# Altium project DiPho_analog.PrjPcb
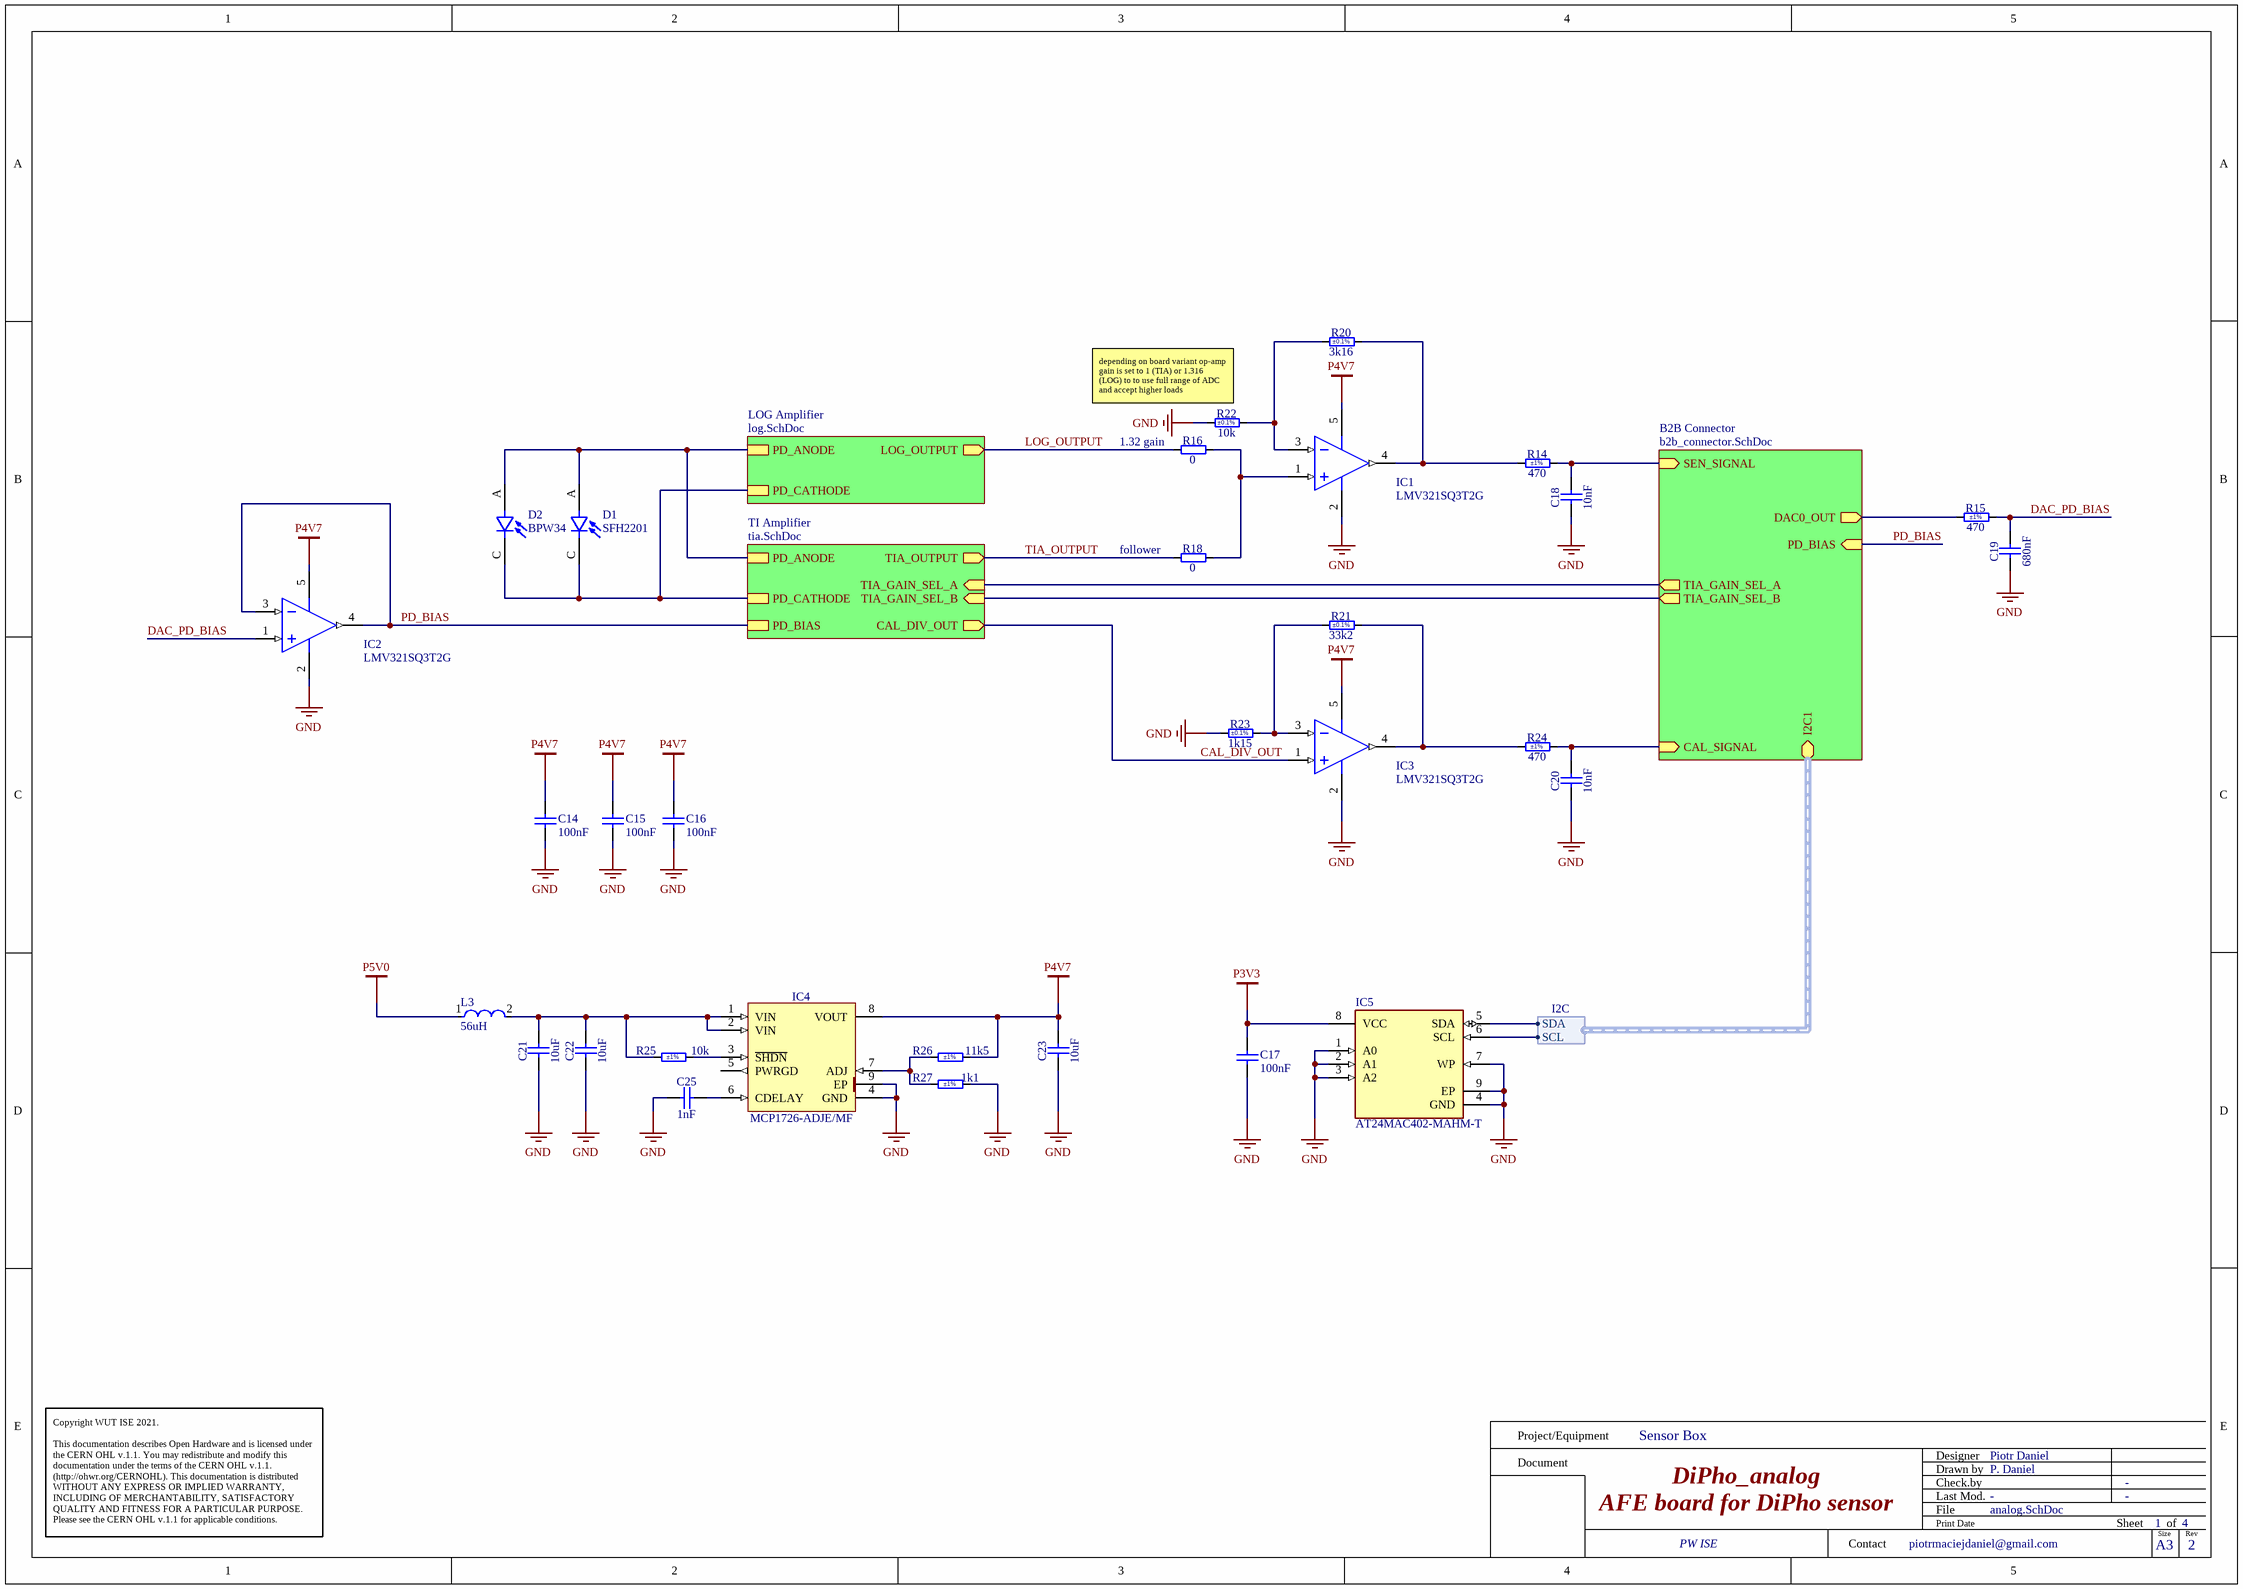
[diagram p0: analog.SchDoc]
4 sheets, 66 parts. Net scope: hierarchical (ports join the sheet entries above them; power ports are global).
Board file: DiPho_AFE.PcbDoc
Sheets:
  analog.SchDoc
    LOG Amplifier = log.SchDoc
    TI Amplifier = tia.SchDoc
    B2B Connector = b2b_connector.SchDoc

## Sheet analog.SchDoc: DiPho_analog
size 420 x 297 mm; Author: P. Daniel; CompanyName: WUT ISE; DrawnBy: P. Daniel; Organization: WUT ISE; Address1: PW ISE; Address2: Nowowiejska 15/19 00-665 Warsaw; Address3: piotrmaciejdaniel@gmail.com; Revision: 2; SheetNumber: 1; SheetTotal: 4; ModifiedBy: -; CheckedDate: -; Title2: AFE board for DiPho sensor; DivGrp: WUT ISE; Designer: Piotr Daniel; ModifiedDate: -; ProjectName: Sensor Box

### Parts
C14  100nF  [CAPC1005X55N]
C15  100nF  [CAPC1005X55N]
C16  100nF  [CAPC1005X55N]
C17  100nF  [CAPC1005X55N]
C18  10nF  [CAPC1005X55N]
C19  680nF  [CAPC1005X55N]
C20  10nF  [CAPC1005X55N]
C21  10uF  [CAPC2012X135N]
C22  10uF  [CAPC2012X135N]
C23  10uF  [CAPC2012X135N]
C25  1nF  [CAPC1005X55N]
D1  SFH2201  [SFH_2201]
D2  BPW34  [BPW34]
IC1  LMV321SQ3T2G  [ONSC-SC70-5-419A-02_K_N]
IC2  LMV321SQ3T2G  [ONSC-SC70-5-419A-02_K_N]
IC3  LMV321SQ3T2G  [ONSC-SC70-5-419A-02_K_N]
IC4  MCP1726-ADJE/MF  [SON65P300X300X100-9N-R160X240]
IC5  AT24MAC402-MAHM-T  [FP-C04-21355-Q4B-MFG]
L3  56uH  [FP-LQH3NPH_ME-MFG]
R14  470  Tolerance: ±1%  [RESC1005X40N]
R15  470  Tolerance: ±1%  [RESC1005X40N]
R16  0  [RESC1005X40N]
R18  0  [RESC1005X40N]
R20  3k16  Tolerance: ±0.1%  [RESC1005X35N]
R21  33k2  Tolerance: ±0.1%  [RESC1005X40N]
R22  10k  Tolerance: ±0.1%  [RESC1005X35N]
R23  1k15  Tolerance: ±0.1%  [RESC1005X35N]
R24  470  Tolerance: ±1%  [RESC1005X40N]
R25  10k  Tolerance: ±1%  [RESC1005X40N]
R26  11k5  Tolerance: ±1%  [RESC1005X40N]
R27  1k1  Tolerance: ±1%  [RESC1005X40N]

### Sub-sheets
B2B Connector = b2b_connector.SchDoc: TIA_GAIN_SEL_A (out), TIA_GAIN_SEL_B (out), I2C1 (bidir, harness I2C), CAL_SIGNAL (in), SEN_SIGNAL (in), DAC0_OUT (out), PD_BIAS (in)
LOG Amplifier = log.SchDoc: LOG_OUTPUT (out), PD_ANODE, PD_CATHODE
TI Amplifier = tia.SchDoc: PD_ANODE, PD_CATHODE, TIA_OUTPUT (out), TIA_GAIN_SEL_A (in), TIA_GAIN_SEL_B (in), PD_BIAS, CAL_DIV_OUT (out)

### Harnesses
I2C: SCL, SDA

### Nets
GND: C14.1 C15.1 C16.1 C17.1 C18.1 C19.1 C20.1 C21.1 C22.1 C23.1 C25.1 IC1.2(V-) IC2.2(V-) IC3.2(V-) IC4.4(GND) IC4.9(EP) IC5.1(A0) IC5.2(A1) IC5.3(A2) IC5.4(GND) IC5.7(WP) IC5.9(EP) R22.1 R23.1 R27.2
P3V3: C17.2 IC5.8(VCC)
P4V7: C14.2 C15.2 C16.2 C23.2 IC1.5(V+) IC2.5(V+) IC3.5(V+) IC4.8(VOUT) R26.2
P5V0: L3.1
CAL_DIV_OUT: IC3.1(IN+) ; sheet TI Amplifier/CAL_DIV_OUT
DAC_PD_BIAS: C19.2 IC2.1(IN+) R15.2
LOG_OUTPUT: R16.1 ; sheet LOG Amplifier/LOG_OUTPUT
PD_BIAS: IC2.3(IN-) IC2.4(OUT) ; sheet TI Amplifier/PD_BIAS, sheet B2B Connector/PD_BIAS
TIA_OUTPUT: R18.1 ; sheet TI Amplifier/TIA_OUTPUT
NetC18_2: C18.2 R14.2 ; sheet B2B Connector/SEN_SIGNAL
NetC20_2: C20.2 R24.2 ; sheet B2B Connector/CAL_SIGNAL
NetC21_2: C21.2 C22.2 IC4.1(VIN) IC4.2(VIN) L3.2 R25.1
NetC25_2: C25.2 IC4.6(CDELAY)
NetD1_A: D1.A D2.A ; sheet LOG Amplifier/PD_ANODE, sheet TI Amplifier/PD_ANODE
NetD1_C: D1.C D2.C ; sheet LOG Amplifier/PD_CATHODE, sheet TI Amplifier/PD_CATHODE
NetIC1_1: IC1.1(IN+) R16.2 R18.2
NetIC1_3: IC1.3(IN-) R20.1 R22.2
NetIC1_4: IC1.4(OUT) R14.1 R20.2
NetIC3_3: IC3.3(IN-) R21.1 R23.2
NetIC3_4: IC3.4(OUT) R21.2 R24.1
NetIC4_3: IC4.3(~{SHDN}) R25.2
NetIC4_7: IC4.7(ADJ) R26.1 R27.1
NetIC5_5: IC5.5(SDA) ; sheet B2B Connector/I2C1.SDA
NetIC5_6: IC5.6(SCL) ; sheet B2B Connector/I2C1.SCL
NetJ1_2: sheet TI Amplifier/TIA_GAIN_SEL_A, sheet B2B Connector/TIA_GAIN_SEL_A
NetJ1_4: sheet TI Amplifier/TIA_GAIN_SEL_B, sheet B2B Connector/TIA_GAIN_SEL_B
NetJ1_8: R15.1 ; sheet B2B Connector/DAC0_OUT

Not connected (* = marked no-connect by the designer): IC4 5(PWRGD)

### Notes on the sheet
- (near R22) depending on board variant op-amp gain is set to 1 (TIA) or 1.316 (LOG) to to use full range of ADC and accept higher loads
- (near R16) 1.32 gain
- (near R18) follower
- Project/Equipment
- Document
- Designer
- Drawn by
- Check.by
- Copyright WUT ISE 2021.
  This documentation describes Open Hardware and is licensed under the CERN OHL v.1.1. You may redistribute and modify this documentation under the terms of the CERN OHL v.1.1. (http://ohwr.org/CERNOHL). This documentation is distributed WITHOUT ANY EXPRESS OR IMPLIED WARRANTY, INCLUDING OF MERCHANTABILITY, SATISFACTORY QUALITY AND FITNESS FOR A PARTICULAR PURPOSE. Please see the CERN OHL v.1.1 for applicable conditions.
- Contact
- File
- Last Mod.
- Print Date
- Sheet
- Size
- A3
- of
- Rev

### Library data of the parts
C14-C17 = CC0402_100NF_16V_10%_X7R: Non-polarised capacitor; Manufacturer: GENERIC; Part Description: SMD Multilayer Chip Ceramic Capacitor; Manufacturer1 Part Number: GRM155R71C104KA88D; Tolerance: ±10%; Voltage: 16V; TC: X7R; Part Number: CC0402_100NF_16V_10%_X7R; Component Kind: Standard; Component Type: Standard; Pin Count: 2; Value: 100nF; Status: Not Recommended; Manufacturer Part Number: CC0402_100NF_16V_10%_X7R; Case: 0402; Mounted: Yes; Socket: No; SMD: Yes; Sense: No; Manufacturer1 Example: MURATA; Manufacturer1 ComponentHeight: 0.55mm; HelpURL: \\cern.ch\dfs\Applications\Altium\Datasheets\CC0402_X7R_MURATA_GRM.pdf; Author: CERN DEM JLC; CreateDate: 05.12.2013; LatestRevisionDate: 03.12.2007
C18 C20 = CC0402_10NF_16V_10%_X7R: Non-polarised capacitor; Part Description: SMD Multilayer Chip Ceramic Capacitor; Manufacturer: GENERIC; Manufacturer1 Part Number: 223878715636; Voltage: 16V; TC: X7R; Tolerance: ±10%; Part Number: CC0402_10NF_16V_10%_X7R; Component Kind: Standard; Component Type: Standard; Pin Count: 2; Value: 10nF; Status: Not Recommended; Manufacturer Part Number: CC0402_10NF_16V_10%_X7R; Case: 0402; Mounted: Yes; Socket: No; SMD: Yes; Sense: No; Manufacturer1 Example: PHYCOMP; Manufacturer1 ComponentHeight: 0.55mm; HelpURL: \\cern.ch\dfs\Applications\Altium\Datasheets\CC0402_X7R_PHYCOMP.pdf; Author: CERN DEM JLC; CreateDate: 03.12.2007; LatestRevisionDate: 03.12.2007
C19 = CC0402_680NF_10V_10%_X5R: Non-polarised capacitor; Part Description: SMD Multilayer Chip Ceramic Capacitor; Manufacturer: GENERIC; Manufacturer1 Part Number: GRM155R61A684KE15; Voltage: 10V; TC: X5R; Tolerance: ±10%; Part Number: CC0402_680NF_10V_10%_X5R; Component Kind: Standard; Component Type: Standard; Pin Count: 2; Value: 680nF; Status: None; Manufacturer Part Number: CC0402_680NF_10V_10%_X5R; Case: 0402; Mounted: Yes; Socket: No; SMD: Yes; Sense: No; Manufacturer1 Example: MURATA; Manufacturer1 ComponentHeight: 0.55mm; HelpURL: \\cern.ch\dfs\Applications\Altium\Datasheets\CC0402_X5R_MURATA_GRM.pdf; Author: CERN DEM BC; CreateDate: 19.04.2021; LatestRevisionDate: 19.04.2021
C21-C23 = CC0805_10UF_10V_10%_X7R: Non-polarised capacitor; Part Description: SMD Multilayer Chip Ceramic Capacitor; Manufacturer: GENERIC; Manufacturer1 Part Number: GRM21BR71A106KE51L; Voltage: 10V; TC: X7R; Tolerance: ±10%; Part Number: CC0805_10UF_10V_10%_X7R; Component Kind: Standard; Component Type: Standard; Pin Count: 2; Value: 10uF; Status: Preferred; Manufacturer Part Number: CC0805_10UF_10V_10%_X7R; Case: 0805; Mounted: Yes; Socket: No; SMD: Yes; Sense: No; Manufacturer1 Example: MURATA; Manufacturer1 ComponentHeight: 1.35mm; HelpURL: \\cern.ch\dfs\Applications\Altium\Datasheets\CC0805_X7R_MURATA.pdf; Author: CERN DEM JLC; CreateDate: 30.04.2012; LatestRevisionDate: 30.04.2012
C25 = CC0402_1NF_50V_10%_X7R: Non-polarised capacitor; Part Description: SMD Multilayer Chip Ceramic Capacitor; Manufacturer: GENERIC; Manufacturer1 Part Number: 223858715623; Voltage: 50V; TC: X7R; Tolerance: ±10%; Part Number: CC0402_1NF_50V_10%_X7R; Component Kind: Standard; Component Type: Standard; Pin Count: 2; Value: 1nF; Status: Not Recommended; Manufacturer Part Number: CC0402_1NF_50V_10%_X7R; Case: 0402; Mounted: Yes; Socket: No; SMD: Yes; Sense: No; Manufacturer1 Example: PHYCOMP; Manufacturer1 ComponentHeight: 0.55mm; HelpURL: \\cern.ch\dfs\Applications\Altium\Datasheets\CC0402_X7R_PHYCOMP.pdf; Author: CERN DEM JLC; CreateDate: 03.12.2007; LatestRevisionDate: 03.12.2007
D2 = BPW34: VISHAY - BPW34 - Photodiode, 65 °, 2 nA, 900 nm, DIP-2; Wavelength: 900nm; Rise Time: 100ns; Dark Current: 2nA; Power Dissipation: 215mW; Reverse Breakdown Voltage: 60V; Viewing Angle: 130°; Diode Type: PIN; Lens Style: Clear; Supplier 1: Digi-Key; Manufacturer: Vishay; Manufacturer Part Number: BPW34; RoHS: Yes; Category: Photodiodes; Stock 1: 56; Pricing 1: 1=1,06000, 10=0,94400, 100=0,73630, 500=0,60822, 1000=0,48018, 2000=0,45300 (USD); Mount: Through Hole,PCB; Case/Package: DIP; Number of Pins: 2; Contact Plating: Tin; Min Operating Temperature: -40°C; Max Operating Temperature: 100°C; Fall Time: 100ns; Packaging: Bulk; Max Reverse Voltage (DC): 60V; Package Quantity: 3000; Max Power Dissipation: 215mW; Reverse Voltage (DC): 60V; Breakdown Voltage: 60V; Length: 4.5mm; Width: 4.3mm; Height: 2mm; Radiation Hardening: No; REACH SVHC: Unknown; Lead Free: Lead Free; ComponentLink1URL: https://datasheet.ciiva.com/1248/33605-1248690.pdf?src-supplier=Element14; ComponentLink1Description: https://datasheet.ciiva.com/1248/33605-1248690.pdf?src-supplier=Element14; ComponentLink2URL: https://datasheet.ciiva.com/1249/bpw34-1249073.pdf?src-supplier=Element14; ComponentLink2Description: https://datasheet.ciiva.com/1249/bpw34-1249073.pdf?src-supplier=Element14; ComponentLink3URL: https://datasheet.ciiva.com/25620/0900766b80de9fc5-25620357.pdf?src-supplier=RSComponents; ComponentLink3Description: https://datasheet.ciiva.com/25620/0900766b80de9fc5-25620357.pdf?src-supplier=RSComponents; ComponentLink4URL: https://datasheet.ciiva.com/4697/bpw34-79369-4697616.pdf?src-supplier=Mouser; ComponentLink4Description: https://datasheet.ciiva.com/4697/bpw34-79369-4697616.pdf?src-supplier=Mouser; ComponentLink5URL: https://datasheet.ciiva.com/1336/6514-1336219.pdf?src-supplier=Newark; ComponentLink5Description: https://datasheet.ciiva.com/1336/6514-1336219.pdf?src-supplier=Newark; ComponentLink6URL: https://datasheet.ciiva.com/4269/2bpw34-4269812.pdf?src-supplier=Arrow+Electronics; ComponentLink6Description: https://datasheet.ciiva.com/4269/2bpw34-4269812.pdf?src-supplier=Arrow+Electronics; ComponentLink7URL: https://datasheet.ciiva.com/15117/getdatasheetpartid-112064-15117125.pdf?src-supplier=Verical; ComponentLink7Description: https://datasheet.ciiva.com/15117/getdatasheetpartid-112064-15117125.pdf?src-supplier=Verical; ComponentLink8URL: https://datasheet.ciiva.com/1248/bpw34-1248686.pdf?src-supplier=Element14; ComponentLink8Description: https://datasheet.ciiva.com/1248/bpw34-1248686.pdf?src-supplier=Element14; ComponentLink9URL: https://datasheet.ciiva.com/1335/1809684-1335889.pdf?src-supplier=Newark; ComponentLink9Description: https://datasheet.ciiva.com/1335/1809684-1335889.pdf?src-supplier=Newark; ComponentLink10URL: https://datasheet.ciiva.com/2819/bpw34-2819744.pdf?src-supplier=Digi-Key; ComponentLink10Description: https://datasheet.ciiva.com/2819/bpw34-2819744.pdf?src-supplier=Digi-Key; ComponentLink11URL: https://datasheet.ciiva.com/8084/bpw34-8084840.pdf?src-supplier=Avnet; ComponentLink11Description: https://datasheet.ciiva.com/8084/bpw34-8084840.pdf?src-supplier=Avnet; Supplier Part Number 1: 751-1015-ND
IC1-IC3 = CMP-1310-00136-1: Single Low-Voltage, Rail-to-Rail Operational Amplifier, 2.7 to 5.5 V, -40 to 85 degC, 5-Pin SC70, Pb-Free, Tape and Reel; Manufacturer: On Semiconductor; VCC Max (V): 5.5; VCC Min (V): 2.7; SR Typ (V/uS): 1; ComponentLink2Description: Datasheet; ComponentLink1URL: http://www.onsemi.com/; DatasheetVersion: Rev. 10; PackageDescription: 5-Pin Small Outline Transistor, Body 2 x 1.25 mm, Pitch 0.65 mm; PartNumber: LMV321SQ3T2G; Packing: Tape and Reel; PackageVersion: Rev. K, 07/2010; ComponentLink1Description: Manufacturer URL; PackageReference: SC70-5-419A-02_K; ComponentLink3Description: Package Specification; GBW Typ (MHz): 1; ComponentLink3URL: http://www.onsemi.cn/pub_link/Collateral/LMV821-D.PDF; ComponentLink2URL: http://www.onsemi.cn/pub_link/Collateral/LMV321-LMV358-LMV324-D.PDF; Mounting Technology: Surface Mount; RoHS: TRUE
IC4 = MCP1726-ADJE/MF: 1A, 0.8V to 5.0V Adjustable , Low Quiescent Current LDO Regulator; Manufacturer: MICROCHIP TECHNOLOGY; PressFit: No; Bonding: No; Part Number: MCP1726-ADJE/MF; Component Kind: Standard; Component Type: Standard; Device: MCP1726-ADJE/MF; PackageDescription: SON, 0.65mm pitch, 8 pin, 3mm X 3mm X 1.00mm H body (w/thermal tab 1.60 X 2.4mm),  IPC Medium Density; Part Description: 1A, 0.8V to 5.0V Adjustable, Low Quiescent Current LDO Regulator; Manufacturer Part Number: MCP1726-ADJE/MF; Pin Count: 8; Case: SON8; Mounted: Yes; Socket: No; SMD: Yes; Sense: No; ComponentHeight: 1mm; HelpURL: \\cern.ch\dfs\Applications\Altium\Datasheets\MCP1726-ADJE-MF.pdf; Author: CERN DEM JLC; CreateDate: 07.02.2012; LatestRevisionDate: 07.02.2012
IC5 = CMP-06313-000089-1: IC EEPROM 2K I2C 1MHZ 8UDFN; Memory Size: 2Kb; Access Time: 550ns; Memory Type: Non-Volatile; Max Operating Temperature: 85°C; Frequency: 1MHz; Min Operating Temperature: -40°C; Packaging: Cut Tape; RoHS Compliant: Yes; Mount: Surface Mount
L3 = CMP-06042-011728-1: Wire Wound Ferrite Inductor for Power Lines 56μH ±20% 1.2Ω 500mA 1212
R14 R15 R24 = R0402_470R_1%_0.0625W_100PPM: Resistor - 1%; Part Description: General Purpose Thick Film Chip Resistor; Manufacturer: GENERIC; Manufacturer1 Part Number: 232270674701L; TC: ±100ppm/°C; PressFit: No; Part Number: R0402_470R_1%_0.0625W_100PPM; Component Kind: Standard; Component Type: Standard; Pin Count: 2; Value: 470; Status: Not Recommended; Power: 0.0625W; Manufacturer Part Number: R0402_470R_1%_0.0625W_100PPM; Case: 0402; Mounted: Yes; Sense: No; Socket: No; SMD: Yes; Manufacturer1 Example: YAGEO PHYCOMP; Manufacturer1 ComponentHeight: 0.4mm; HelpURL: \\cern.ch\dfs\Applications\Altium\Datasheets\R0402_Phycomp_RC0402.pdf; Author: CERN DEM JLC; CreateDate: 03.12.2007; LatestRevisionDate: 17.10.2012
R16 R18 = R0402_0R_JUMPER: Resistor; Part Description: 1A (0.05R Max DC Resistance) Zero Ohm Jumper; Manufacturer: GENERIC; Manufacturer1 Part Number: 232270591001L; PressFit: No; Part Number: R0402_0R_JUMPER; Component Kind: Standard; Component Type: Standard; Pin Count: 2; Value: 0; Status: Not Recommended; Manufacturer Part Number: R0402_0R_JUMPER; Case: 0402; Mounted: Yes; Sense: No; Socket: No; SMD: Yes; Manufacturer1 Example: YAGEO PHYCOMP; Manufacturer1 ComponentHeight: 0.4mm; HelpURL: \\cern.ch\dfs\Applications\Altium\Datasheets\R0402_Phycomp_RC0402.pdf; Author: CERN DEM JLC; CreateDate: 03.12.2007; LatestRevisionDate: 17.10.2012
R20 R23 = R0402_10K_0.1%_0.063W_25PPM: Resistor - 0.1%; Part Description: Thin Film Precision Resistor; Manufacturer: GENERIC; Manufacturer1 Part Number: CPF0402B10KE1; Value: 10k; Power: 0.063W; TC: ±25ppm/°C; PressFit: No; Part Number: R0402_10K_0.1%_0.063W_25PPM; Component Kind: Standard; Component Type: Standard; Pin Count: 2; Status: Not Recommended; Manufacturer Part Number: R0402_10K_0.1%_0.063W_25PPM; Case: 0402; Mounted: Yes; Sense: No; Socket: No; SMD: Yes; Manufacturer1 Example: TE CONNECTIVITY; Manufacturer1 ComponentHeight: 0.35mm; HelpURL: \\cern.ch\dfs\Applications\Altium\Datasheets\R0402_TYCO_CPF.pdf; Author: CERN DEM JMW; CreateDate: 22.09.2015; LatestRevisionDate: 22.09.2015
R21 = R0402_33K2_0.1%_0.063W_25PPM: Resistor - 0.1%; Part Description: Thin Film Precision Resistor; Manufacturer: GENERIC; Manufacturer1 Part Number: ERA2AEB3322X; Power: 0.063W; TC: ±25ppm/°C; Voltage: 50V; PressFit: No; Part Number: R0402_33K2_0.1%_0.063W_25PPM; Component Kind: Standard; Component Type: Standard; Pin Count: 2; Value: 33k2; Status: Not Recommended; Manufacturer Part Number: R0402_33K2_0.1%_0.063W_25PPM; Case: 0402; Mounted: Yes; Sense: No; Socket: No; SMD: Yes; Manufacturer1 Example: PANASONIC; Manufacturer1 ComponentHeight: 0.4mm; HelpURL: \\cern.ch\dfs\Applications\Altium\Datasheets\R0402_PANASONIC_ERA.pdf; Author: CERN DEM BC; CreateDate: 09.07.2020; LatestRevisionDate: 09.07.2020
R22 = R0402_10K_0.1%_0.063W_25PPM: Resistor - 0.1%; Part Description: Thin Film Precision Resistor; Manufacturer: GENERIC; Manufacturer1 Part Number: CPF0402B10KE1; Power: 0.063W; TC: ±25ppm/°C; PressFit: No; Part Number: R0402_10K_0.1%_0.063W_25PPM; Component Kind: Standard; Component Type: Standard; Pin Count: 2; Value: 10k; Status: Not Recommended; Manufacturer Part Number: R0402_10K_0.1%_0.063W_25PPM; Case: 0402; Mounted: Yes; Sense: No; Socket: No; SMD: Yes; Manufacturer1 Example: TE CONNECTIVITY; Manufacturer1 ComponentHeight: 0.35mm; HelpURL: \\cern.ch\dfs\Applications\Altium\Datasheets\R0402_TYCO_CPF.pdf; Author: CERN DEM JMW; CreateDate: 22.09.2015; LatestRevisionDate: 22.09.2015
R25 = R0402_10K_1%_0.0625W_100PPM: Resistor - 1%; Part Description: General Purpose Thick Film Chip Resistor; Manufacturer: GENERIC; Manufacturer1 Part Number: 232270671003L; TC: ±100ppm/°C; PressFit: No; Part Number: R0402_10K_1%_0.0625W_100PPM; Component Kind: Standard; Component Type: Standard; Pin Count: 2; Value: 10k; Status: Not Recommended; Power: 0.0625W; Manufacturer Part Number: R0402_10K_1%_0.0625W_100PPM; Case: 0402; Mounted: Yes; Sense: No; Socket: No; SMD: Yes; Manufacturer1 Example: YAGEO PHYCOMP; Manufacturer1 ComponentHeight: 0.4mm; HelpURL: \\cern.ch\dfs\Applications\Altium\Datasheets\R0402_Phycomp_RC0402.pdf; Author: CERN DEM JLC; CreateDate: 03.12.2007; LatestRevisionDate: 17.10.2012
R26 = R0402_11K5_1%_0.063W_100PPM: Resistor - 1%; Part Description: Standard Thick Film Chip Resistor; Manufacturer: GENERIC; Manufacturer1 Part Number: CRCW040211K5FK; Power: 0.063W; TC: ±100ppm/°C; PressFit: No; Part Number: R0402_11K5_1%_0.063W_100PPM; Component Kind: Standard; Component Type: Standard; Pin Count: 2; Value: 11k5; Status: None; Manufacturer Part Number: R0402_11K5_1%_0.063W_100PPM; Case: 0402; Mounted: Yes; Sense: No; Socket: No; SMD: Yes; Manufacturer1 Example: VISHAY; Manufacturer1 ComponentHeight: 0.4mm; HelpURL: \\cern.ch\dfs\Applications\Altium\Datasheets\R0402_VISHAY_CRCW e3.pdf; Author: CERN DEM BC; CreateDate: 02.06.2020; LatestRevisionDate: 02.06.2020
R27 = R0402_1K1_1%_0.0625W_100PPM: Resistor - 1%; Part Description: General Purpose Thick Film Chip Resistor; Manufacturer: GENERIC; Manufacturer1 Part Number: 232270671102L; TC: ±100ppm/°C; PressFit: No; Part Number: R0402_1K1_1%_0.0625W_100PPM; Component Kind: Standard; Component Type: Standard; Pin Count: 2; Value: 1k1; Status: Not Recommended; Power: 0.0625W; Manufacturer Part Number: R0402_1K1_1%_0.0625W_100PPM; Case: 0402; Mounted: Yes; Sense: No; Socket: No; SMD: Yes; Manufacturer1 Example: YAGEO PHYCOMP; Manufacturer1 ComponentHeight: 0.4mm; HelpURL: \\cern.ch\dfs\Applications\Altium\Datasheets\R0402_Phycomp_RC0402.pdf; Author: CERN DEM JLC; CreateDate: 03.12.2007; LatestRevisionDate: 17.10.2012

## Sheet log.SchDoc
size 420 x 297 mm; SheetNumber: 3; SheetTotal: 4; ModifiedBy: -; CheckedDate: -; Title2: xxx; DivGrp: WUT ISE; Designer: G.Kasprowicz
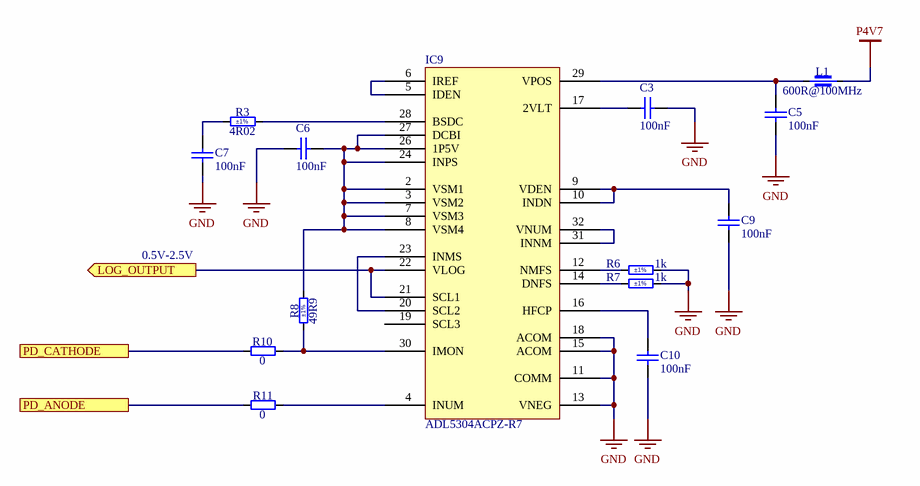
[diagram p1: log.SchDoc]

### Parts
C3  100nF  [CAPC1005X55N]
C5  100nF  [CAPC1005X55N]
C6  100nF  [CAPC1005X55N]
C7  100nF  [CAPC1005X55N]
C9  100nF  [CAPC1005X55N]
C10  100nF  [CAPC1005X55N]
IC9  ADL5304ACPZ-R7  [LFCSP32]
L1  600R@100MHz  [INDC1005X55N]
R3  4R02  Tolerance: ±1%  [RESC1005X40N]
R6  1k  Tolerance: ±1%  [RESC1005X40N]
R7  1k  Tolerance: ±1%  [RESC1005X40N]
R8  49R9  Tolerance: ±1%  [RESC1005X40N]
R10  0  [RESC1005X40N]
R11  0  [RESC1005X40N]

### Ports
LOG_OUTPUT (out), PD_ANODE, PD_CATHODE

### Nets
GND: C3.1 C5.1 C6.2 C7.2 C9.1 C10.1 IC9.11(COMM) IC9.13(VNEG) IC9.15(ACOM) IC9.18(ACOM) R6.2 R7.2
P4V7: L1.2
LOG_OUTPUT: IC9.21(SCL1) IC9.22(VLOG) ; port LOG_OUTPUT
NetC3_2: C3.2 IC9.17(2VLT)
NetC5_2: C5.2 IC9.29(VPOS) L1.1
NetC6_1: C6.1 IC9.2(VSM1) IC9.3(VSM2) IC9.7(VSM3) IC9.8(VSM4) IC9.24(INPS) IC9.26(1P5V) IC9.27(DCBI) R8.2
NetC7_1: C7.1 R3.1
NetC9_2: C9.2 IC9.9(VDEN) IC9.10(INDN)
NetC10_2: C10.2 IC9.16(HFCP)
NetD1_A: R11.1 ; port PD_ANODE
NetD1_C: R10.1 ; port PD_CATHODE
NetIC9_4: IC9.4(INUM) R11.2
NetIC9_5: IC9.5(IDEN) IC9.6(IREF)
NetIC9_12: IC9.12(NMFS) R6.1
NetIC9_14: IC9.14(DNFS) R7.1
NetIC9_20: IC9.20(SCL2) IC9.23(INMS)
NetIC9_28: IC9.28(BSDC) R3.2
NetIC9_30: IC9.30(IMON) R8.1 R10.2
NetIC9_31: IC9.31(INNM) IC9.32(VNUM)

Not connected (* = marked no-connect by the designer): IC9 19(SCL3)

### Notes on the sheet
- 0.5V-2.5V
- Project/Equipment
- Document
- Designer
- Drawn by
- Check.by
- Copyright WUT ISE 2021.
  This documentation describes Open Hardware and is licensed under the CERN OHL v.1.1. You may redistribute and modify this documentation under the terms of the CERN OHL v.1.1. (http://ohwr.org/CERNOHL). This documentation is distributed WITHOUT ANY EXPRESS OR IMPLIED WARRANTY, INCLUDING OF MERCHANTABILITY, SATISFACTORY QUALITY AND FITNESS FOR A PARTICULAR PURPOSE. Please see the CERN OHL v.1.1 for applicable conditions.
- Contact
- File
- Last Mod.
- Print Date
- Sheet
- Size
- A3
- of
- Rev

### Library data of the parts
C3 C5-C7 C9 C10 = CC0402_100NF_16V_10%_X7R: as C14 on sheet analog; Part Number: CC0402_100NF_16V_10%_X7R; Component Kind: Standard; Component Type: Standard; Pin Count: 2; Value: 100nF; Status: Not Recommended; Manufacturer Part Number: CC0402_100NF_16V_10%_X7R; Case: 0402; Mounted: Yes; Socket: No; SMD: Yes; Sense: No; Manufacturer1 Example: MURATA; Manufacturer1 ComponentHeight: 0.55mm; HelpURL: \\cern.ch\dfs\Applications\Altium\Datasheets\CC0402_X7R_MURATA_GRM.pdf; Author: CERN DEM JLC; CreateDate: 05.12.2013; LatestRevisionDate: 03.12.2007
IC9 = ADL5304ACPZ-R7: SP Amp LOG Amp Single 5.5V 32-Pin LFCSP EP T/R; Manufacturer: Analog Devices; Min Supply Voltage: 4.5V; Operating Supply Current: 20.8mA; Number of Channels: 1; Operating Supply Voltage: 5V; -3db Bandwidth: 4MHz; Max Power Dissipation: 600mW; Number of Elements: 3; Input Offset Voltage (Vos): 600mV; Linearity: 2%; Supplier 1: Digi-Key; Manufacturer Part Number: ADL5304ACPZ-R7; RoHS: Yes; Category: Amplifiers - Op Amps, Buffer, Instrumentation; Stock 1: 3298; Pricing 1: 1=21,42000, 10=19,75500, 25=18,86680, 100=16,86930, 250=16,09240, 500=15,70500 (USD); Mount: Surface Mount; Case/Package: LFCSP EP; Number of Pins: 32; Contact Plating: Tin,Matte; Min Operating Temperature: -40°C; Max Operating Temperature: 85°C; Max Supply Voltage: 5.5V; Packaging: Tape and Reel; Package Quantity: 1; Power Dissipation: 600mW; Number of Amplifiers: 3; Series: -; Lead Free: Contains Lead; RoHS Compliant: Yes; REACH SVHC: No SVHC; ComponentLink1URL: https://datasheet.ciiva.com/1823/adl5304-1823090.pdf?src-supplier=Digi-Key; ComponentLink1Description: https://datasheet.ciiva.com/1823/adl5304-1823090.pdf?src-supplier=Digi-Key; ComponentLink2URL: https://datasheet.ciiva.com/1823/adl5304-1823091.pdf?src-supplier=Digi-Key; ComponentLink2Description: https://datasheet.ciiva.com/1823/adl5304-1823091.pdf?src-supplier=Digi-Key; ComponentLink3URL: https://datasheet.ciiva.com/2965/adl5304-2965478.pdf?src-supplier=Avnet; ComponentLink3Description: https://datasheet.ciiva.com/2965/adl5304-2965478.pdf?src-supplier=Avnet; ComponentLink4URL: https://datasheet.ciiva.com/46392/1501172-46392079.pdf?src-supplier=Element14; ComponentLink4Description: https://datasheet.ciiva.com/46392/1501172-46392079.pdf?src-supplier=Element14; ComponentLink5URL: https://datasheet.ciiva.com/1823/adl5304-1823092.pdf?src-supplier=Digi-Key; ComponentLink5Description: https://datasheet.ciiva.com/1823/adl5304-1823092.pdf?src-supplier=Digi-Key; ComponentLink6URL: https://datasheet.ciiva.com/17372/adl5304-17372079.pdf?src-supplier=Avnet+Europe; ComponentLink6Description: https://datasheet.ciiva.com/17372/adl5304-17372079.pdf?src-supplier=Avnet+Europe; Supplier Part Number 1: ADL5304ACPZ-R7CT-ND
L1 = IND0402_MURATA_BLM15HD601SN1: Part Description: SMD EMIFIL Suppression Chip Ferrite Bead; Manufacturer: MURATA; Manufacturer Part Number: BLM15HD601SN1D; Power: 300mA; Resistance: 0.85R; Tolerance: ±25%; Part Number: IND0402_MURATA_BLM15HD601SN1; Component Kind: Standard; Component Type: Standard; Pin Count: 2; Value: 600R@100MHz; Status: None; Case: 0402; Mounted: Yes; Socket: No; SMD: Yes; Sense: No; ComponentHeight: 0.55mm; HelpURL: \\cern.ch\dfs\Applications\Altium\Datasheets\IND0402_MURATA_BLM15H.pdf; Author: CERN DEM JLC; CreateDate: 28.02.2012; LatestRevisionDate: 25.10.2018
R3 = R0402_4R02_1%_0.063W_100PPM: Resistor - 1%; Part Description: General Purpose Thick Film Chip Resistor; Manufacturer: GENERIC; Manufacturer1 Part Number: CRCW04024R02FK; Power: 0.063W; TC: ±100ppm/°C; PressFit: No; Part Number: R0402_4R02_1%_0.063W_100PPM; Component Kind: Standard; Component Type: Standard; Pin Count: 2; Value: 4R02; Status: None; Manufacturer Part Number: R0402_4R02_1%_0.063W_100PPM; Case: 0402; Mounted: Yes; Sense: No; Socket: No; SMD: Yes; Manufacturer1 Example: VISHAY; Manufacturer1 ComponentHeight: 0.4mm; HelpURL: \\cern.ch\dfs\Applications\Altium\Datasheets\R0402_VISHAY_CRCW e3.pdf; Author: CERN DEM BC; CreateDate: 18.11.2020; LatestRevisionDate: 18.11.2020
R6 R7 = R0402_1K_1%_0.0625W_100PPM: Resistor - 1%; Part Description: General Purpose Thick Film Chip Resistor; Manufacturer: GENERIC; Manufacturer1 Part Number: 232270671002L; TC: ±100ppm/°C; PressFit: No; Part Number: R0402_1K_1%_0.0625W_100PPM; Component Kind: Standard; Component Type: Standard; Pin Count: 2; Value: 1k; Status: Not Recommended; Power: 0.0625W; Manufacturer Part Number: R0402_1K_1%_0.0625W_100PPM; Case: 0402; Mounted: Yes; Sense: No; Socket: No; SMD: Yes; Manufacturer1 Example: YAGEO PHYCOMP; Manufacturer1 ComponentHeight: 0.4mm; HelpURL: \\cern.ch\dfs\Applications\Altium\Datasheets\R0402_Phycomp_RC0402.pdf; Author: CERN DEM JLC; CreateDate: 03.12.2007; LatestRevisionDate: 17.10.2012
R8 = R0402_49R9_1%_0.0625W_100PPM: Resistor - 1%; Part Description: General Purpose Thick Film Chip Resistor; Manufacturer: GENERIC; Manufacturer1 Part Number: 232270674999L or RC0402FR-0749R9L; TC: ±100ppm/°C; PressFit: No; Part Number: R0402_49R9_1%_0.0625W_100PPM; Component Kind: Standard; Component Type: Standard; Pin Count: 2; Value: 49R9; Status: Not Recommended; Power: 0.0625W; Manufacturer Part Number: R0402_49R9_1%_0.0625W_100PPM; Case: 0402; Mounted: Yes; Sense: No; Socket: No; SMD: Yes; Manufacturer1 Example: YAGEO PHYCOMP; Manufacturer1 ComponentHeight: 0.4mm; HelpURL: \\cern.ch\dfs\Applications\Altium\Datasheets\R0402_Phycomp_RC0402.pdf; Author: CERN DEM JLC; CreateDate: 24.10.2012; LatestRevisionDate: 24.10.2012
R10 R11 = R0402_0R_JUMPER: as R16 on sheet analog; Part Number: R0402_0R_JUMPER; Component Kind: Standard; Component Type: Standard; Pin Count: 2; Value: 0; Status: Not Recommended; Manufacturer Part Number: R0402_0R_JUMPER; Case: 0402; Mounted: Yes; Sense: No; Socket: No; SMD: Yes; Manufacturer1 Example: YAGEO PHYCOMP; Manufacturer1 ComponentHeight: 0.4mm; HelpURL: \\cern.ch\dfs\Applications\Altium\Datasheets\R0402_Phycomp_RC0402.pdf; Author: CERN DEM JLC; CreateDate: 03.12.2007; LatestRevisionDate: 17.10.2012

## Sheet tia.SchDoc
size 420 x 297 mm; SheetNumber: 2; SheetTotal: 4; ModifiedBy: -; CheckedDate: -; Title2: xxx; DivGrp: WUT ISE; Designer: G.Kasprowicz
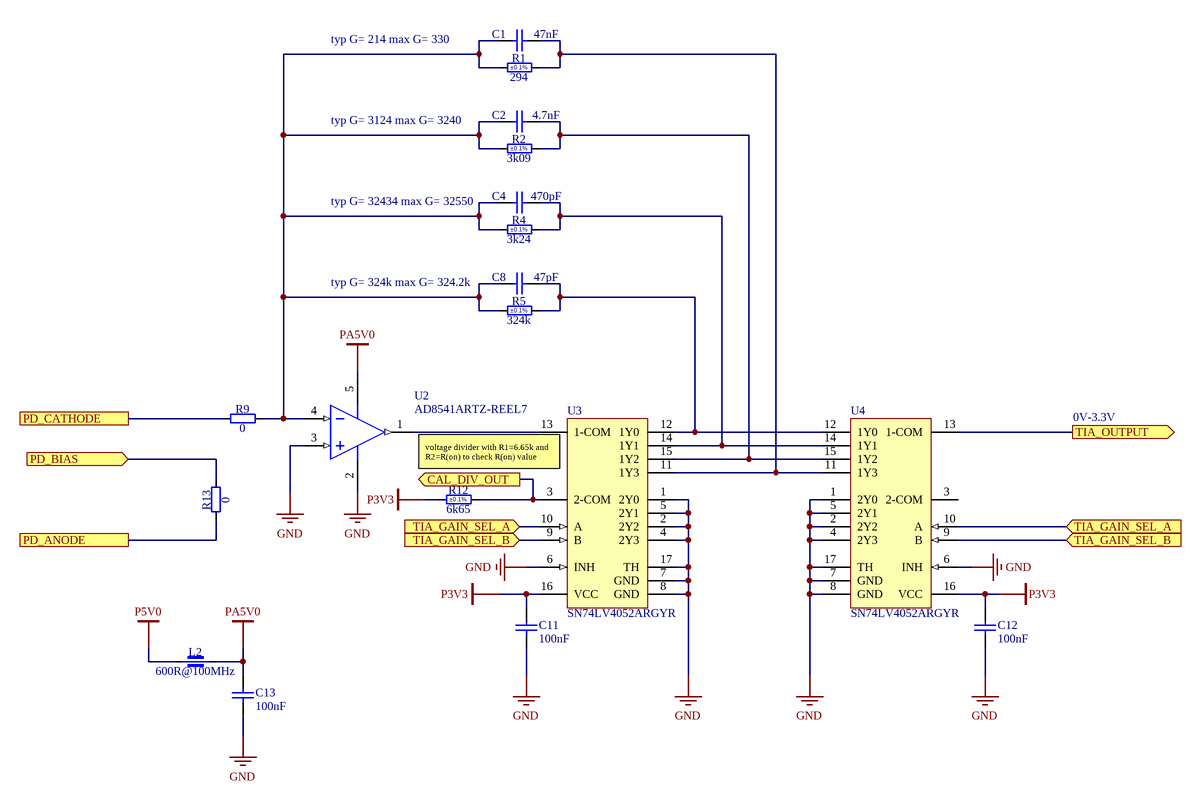
[diagram p2: tia.SchDoc]

### Parts
C1  47nF  [CAPC1005X55N]
C2  4.7nF  [CAPC1005X55N]
C4  470pF  [CAPC1005X55N]
C8  47pF  [CAPC1005X55N]
C11  100nF  [CAPC1005X55N]
C12  100nF  [CAPC1005X55N]
C13  100nF  [CAPC1005X55N]
L2  600R@100MHz  [INDC1005X55N]
R1  294  Tolerance: ±0.1%  [RESC1005X40N]
R2  3k09  Tolerance: ±0.1%  [RESC1005X40N]
R4  3k24  Tolerance: ±0.1%  [RESC1005X40N]
R5  324k  Tolerance: ±0.1%  [RESC1005X40N]
R9  0  [RESC1005X40N]
R12  6k65  Tolerance: ±0.1%  [RESC1005X40N]
R13  0  [RESC1005X40N]
U2  AD8541ARTZ-REEL7  [ADI-RJ-5_N]
U3  SN74LV4052ARGYR  [FP-RGY0016A-MFG]
U4  SN74LV4052ARGYR  [FP-RGY0016A-MFG]

### Ports
CAL_DIV_OUT (out), PD_ANODE, PD_BIAS (in), PD_CATHODE, TIA_GAIN_SEL_A (in), TIA_GAIN_SEL_B (in), TIA_OUTPUT (out)

### Nets
GND: C11.1 C12.1 C13.1 U2.2(-V) U2.3(+IN_A) U3.1(2Y0) U3.2(2Y2) U3.4(2Y3) U3.5(2Y1) U3.6(INH) U3.7(GND) U3.8(GND) U3.17(TH) U4.1(2Y0) U4.2(2Y2) U4.4(2Y3) U4.5(2Y1) U4.6(INH) U4.7(GND) U4.8(GND) U4.17(TH)
P3V3: C11.2 C12.2 R12.1 U3.16(VCC) U4.16(VCC)
P5V0: L2.1
PA5V0: C13.2 L2.2 U2.5(+V)
CAL_DIV_OUT: R12.2 U3.3(2-COM) ; port CAL_DIV_OUT
PD_BIAS: R13.2 ; port PD_BIAS
TIA_OUTPUT: U4.13(1-COM) ; port TIA_OUTPUT
NetC1_1: C1.1 C2.1 C4.1 C8.1 R1.1 R2.1 R4.1 R5.1 R9.2 U2.4(-IN_A)
NetC1_2: C1.2 R1.2 U3.11(1Y3) U4.11(1Y3)
NetC2_2: C2.2 R2.2 U3.15(1Y2) U4.15(1Y2)
NetC4_2: C4.2 R4.2 U3.14(1Y1) U4.14(1Y1)
NetC8_2: C8.2 R5.2 U3.12(1Y0) U4.12(1Y0)
NetD1_A: R13.1 ; port PD_ANODE
NetD1_C: R9.1 ; port PD_CATHODE
NetJ1_2: U3.10(A) U4.10(A) ; port TIA_GAIN_SEL_A
NetJ1_4: U3.9(B) U4.9(B) ; port TIA_GAIN_SEL_B
NetU2_1: U2.1(OUT_A) U3.13(1-COM)

Not connected (* = marked no-connect by the designer): U4 3(2-COM)

### Notes on the sheet
- typ G= 214 max G= 330
- typ G= 3124 max G= 3240
- typ G= 32434 max G= 32550
- typ G= 324k max G= 324.2k
- 0V-3.3V
- (near U3) voltage divider with R1=6.65k and R2=R(on) to check R(on) value
- Project/Equipment
- Document
- Designer
- Drawn by
- Check.by
- Copyright WUT ISE 2021.
  This documentation describes Open Hardware and is licensed under the CERN OHL v.1.1. You may redistribute and modify this documentation under the terms of the CERN OHL v.1.1. (http://ohwr.org/CERNOHL). This documentation is distributed WITHOUT ANY EXPRESS OR IMPLIED WARRANTY, INCLUDING OF MERCHANTABILITY, SATISFACTORY QUALITY AND FITNESS FOR A PARTICULAR PURPOSE. Please see the CERN OHL v.1.1 for applicable conditions.
- Contact
- File
- Last Mod.
- Print Date
- Sheet
- Size
- A3
- of
- Rev

### Library data of the parts
C1 = CC0402_47NF_16V_10%_X7R: Non-polarised capacitor; Part Description: SMD Multilayer Chip Ceramic Capacitor; Manufacturer: GENERIC; Manufacturer1 Part Number: 223878715645; Voltage: 16V; TC: X7R; Tolerance: ±10%; Part Number: CC0402_47NF_16V_10%_X7R; Component Kind: Standard; Component Type: Standard; Pin Count: 2; Value: 47nF; Status: Not Recommended; Manufacturer Part Number: CC0402_47NF_16V_10%_X7R; Case: 0402; Mounted: Yes; Socket: No; SMD: Yes; Sense: No; Manufacturer1 Example: PHYCOMP; Manufacturer1 ComponentHeight: 0.55mm; HelpURL: \\cern.ch\dfs\Applications\Altium\Datasheets\CC0402_X7R_PHYCOMP.pdf; Author: CERN DEM JLC; CreateDate: 03.12.2007; LatestRevisionDate: 03.12.2007
C2 = CC0402_4.7NF_16V_10%_X7R: Non-polarised capacitor; Part Description: SMD Multilayer Chip Ceramic Capacitor; Manufacturer: GENERIC; Manufacturer1 Part Number: 223878715632; Voltage: 16V; TC: X7R; Tolerance: ±10%; Part Number: CC0402_4.7NF_16V_10%_X7R; Component Kind: Standard; Component Type: Standard; Pin Count: 2; Value: 4.7nF; Status: Not Recommended; Manufacturer Part Number: CC0402_4.7NF_16V_10%_X7R; Case: 0402; Mounted: Yes; Socket: No; SMD: Yes; Sense: No; Manufacturer1 Example: PHYCOMP; Manufacturer1 ComponentHeight: 0.55mm; HelpURL: \\cern.ch\dfs\Applications\Altium\Datasheets\CC0402_X7R_PHYCOMP.pdf; Author: CERN DEM JLC; CreateDate: 03.12.2007; LatestRevisionDate: 03.12.2007
C4 = CC0402_470PF_50V_10%_X7R: Non-polarised capacitor; Part Description: SMD Multilayer Chip Ceramic Capacitor; Manufacturer: GENERIC; Manufacturer1 Part Number: 223858715618; Voltage: 50V; TC: X7R; Tolerance: ±10%; Part Number: CC0402_470PF_50V_10%_X7R; Component Kind: Standard; Component Type: Standard; Pin Count: 2; Value: 470pF; Status: Not Recommended; Manufacturer Part Number: CC0402_470PF_50V_10%_X7R; Case: 0402; Mounted: Yes; Socket: No; SMD: Yes; Sense: No; Manufacturer1 Example: PHYCOMP; Manufacturer1 ComponentHeight: 0.55mm; HelpURL: \\cern.ch\dfs\Applications\Altium\Datasheets\CC0402_NP0_PHYCOMP.pdf; Author: CERN DEM JLC; CreateDate: 03.12.2007; LatestRevisionDate: 03.12.2007
C8 = CC0402_47PF_50V_5%_C0G: Non-polarised capacitor; Part Description: SMD Multilayer Chip Ceramic Capacitor; Manufacturer: GENERIC; Manufacturer1 Part Number: C0402C470J5GACTU; Voltage: 50V; TC: C0G/NP0; Tolerance: ±5%; Part Number: CC0402_47PF_50V_5%_C0G; Component Kind: Standard; Component Type: Standard; Pin Count: 2; Value: 47pF; Status: Preferred; Manufacturer Part Number: CC0402_47PF_50V_5%_C0G; Case: 0402; Mounted: Yes; Socket: No; SMD: Yes; Sense: No; Manufacturer1 Example: KEMET; Manufacturer1 ComponentHeight: 0.55mm; HelpURL: \\cern.ch\dfs\Applications\Altium\Datasheets\CC0402_C0G_KEMET_(Commercial Grade).pdf; Author: CERN DEM JLC; CreateDate: 03.12.2007; LatestRevisionDate: 22.04.2015
C11-C13 = CC0402_100NF_16V_10%_X7R: as C14 on sheet analog; Part Number: CC0402_100NF_16V_10%_X7R; Component Kind: Standard; Component Type: Standard; Pin Count: 2; Value: 100nF; Status: Not Recommended; Manufacturer Part Number: CC0402_100NF_16V_10%_X7R; Case: 0402; Mounted: Yes; Socket: No; SMD: Yes; Sense: No; Manufacturer1 Example: MURATA; Manufacturer1 ComponentHeight: 0.55mm; HelpURL: \\cern.ch\dfs\Applications\Altium\Datasheets\CC0402_X7R_MURATA_GRM.pdf; Author: CERN DEM JLC; CreateDate: 05.12.2013; LatestRevisionDate: 03.12.2007
L2 = IND0402_MURATA_BLM15HD601SN1: as L1 on sheet log; Part Number: IND0402_MURATA_BLM15HD601SN1; Component Kind: Standard; Component Type: Standard; Pin Count: 2; Value: 600R@100MHz; Status: None; Case: 0402; Mounted: Yes; Socket: No; SMD: Yes; Sense: No; ComponentHeight: 0.55mm; HelpURL: \\cern.ch\dfs\Applications\Altium\Datasheets\IND0402_MURATA_BLM15H.pdf; Author: CERN DEM JLC; CreateDate: 28.02.2012; LatestRevisionDate: 25.10.2018
R1 R2 R4 R5 R12 = R0402_10K_1%_0.0625W_100PPM: Resistor - 1%; Part Description: General Purpose Thick Film Chip Resistor; Manufacturer: GENERIC; Manufacturer1 Part Number: 232270671003L; Value: 10k; TC: ±100ppm/°C; PressFit: No; Part Number: R0402_10K_1%_0.0625W_100PPM; Component Kind: Standard; Component Type: Standard; Pin Count: 2; Status: Not Recommended; Power: 0.0625W; Manufacturer Part Number: R0402_10K_1%_0.0625W_100PPM; Case: 0402; Mounted: Yes; Sense: No; Socket: No; SMD: Yes; Manufacturer1 Example: YAGEO PHYCOMP; Manufacturer1 ComponentHeight: 0.4mm; HelpURL: \\cern.ch\dfs\Applications\Altium\Datasheets\R0402_Phycomp_RC0402.pdf; Author: CERN DEM JLC; CreateDate: 03.12.2007; LatestRevisionDate: 17.10.2012
R9 R13 = R0402_0R_JUMPER: as R16 on sheet analog; Part Number: R0402_0R_JUMPER; Component Kind: Standard; Component Type: Standard; Pin Count: 2; Value: 0; Status: Not Recommended; Manufacturer Part Number: R0402_0R_JUMPER; Case: 0402; Mounted: Yes; Sense: No; Socket: No; SMD: Yes; Manufacturer1 Example: YAGEO PHYCOMP; Manufacturer1 ComponentHeight: 0.4mm; HelpURL: \\cern.ch\dfs\Applications\Altium\Datasheets\R0402_Phycomp_RC0402.pdf; Author: CERN DEM JLC; CreateDate: 03.12.2007; LatestRevisionDate: 17.10.2012
U2 = CMP-0384-01498-2: Single Channel RRIO Operational Amplifier, 1 MHz BW, 920 mV/us SR, Industrial, 5-pin SOT23 (RJ-5), Reel; Manufacturer: Analog Devices; Generic Part Number: AD8541; Input Bias Current: 4pA; V Span Max: 5.5V; Amplifiers Per Package: 1; Small Signal Bandwidth: 1MHz; Input Offset Voltage: 1mV; Iq/Amp: 65uA; V Span Min: 2.7V; ComponentLink1URL: http://www.analog.com/en/index.html; ComponentLink2URL: http://www.analog.com/static/imported-files/data_sheets/AD8541_8542_8544.pdf; ComponentLink3Description: Package Specification; ComponentLink3URL: http://www.analog.com/static/imported-files/packages/PKG_PDF/SOT-23(RJ)/RJ_5.pdf; Slew Rate: 920mV/us; Mounting Technology: Surface Mount; ComponentLink4URL: http://www.analog.com/en/all-operational-amplifiers-op-amps/operational-amplifiers-op-amps/ad8541/products/product.html#product-recommendations; DatasheetVersion: Rev. G; ComponentLink1Description: Manufacturer URL; PackageVersion: 121608-A; ComponentLink2Description: Datasheet; RevisionNote: Reference Circuit URL fixed; PartNumber: AD8541ARTZ-REEL7; PackageDescription: 5-Pin Small Outline Transistor Package, Body 2.9 x 1.6 mm, Pitch 0.95 mm; ComponentLink4Description: Reference Circuit; PackageReference: RJ-5; Code_JEDEC: MO-178-AA
U3 U4 = SN74LV4052ARGYR: IC MULTIPLEXER DUAL 4X1 16VQFN; Supply Type: Single; Number of Bits: 4; Turn-Off Delay Time: 28ns; Number of Outputs: 2; Supply Current: 20uA; Propagation Delay: 12ns; On-State Resistance: 100R; Max Supply Voltage: 5.5V; Min Supply Voltage: 2V; Polarity: Non-Inverting; Bandwidth: 50MHz; Throw Configuration: SP4T; Number of Inputs: 8; Nominal Supply Current: 20uA; Min Operating Temperature: -40°C; RoHS Compliant: Yes; Max Operating Temperature: 85°C; Number of Channels: 2; Lead Free: Lead Free; Operating Supply Current: 20uA; Mount: Surface Mount; Number of Pins: 16; Package Quantity: 3000; Logic Function: Multiplexer; Packaging: Tape and Reel; Case/Package: VQFN; Series: 74LV; Radiation Hardening: No; Weight: 0.001312oz; REACH SVHC: No SVHC; Turn-On Delay Time: 28ns; Number of Switches: 2; Number of Circuits: 2

## Sheet b2b_connector.SchDoc
size 420 x 297 mm; SheetNumber: 4; SheetTotal: 4; ModifiedBy: -; CheckedDate: -; Title2: xxx; DivGrp: WUT ISE; Designer: G.Kasprowicz
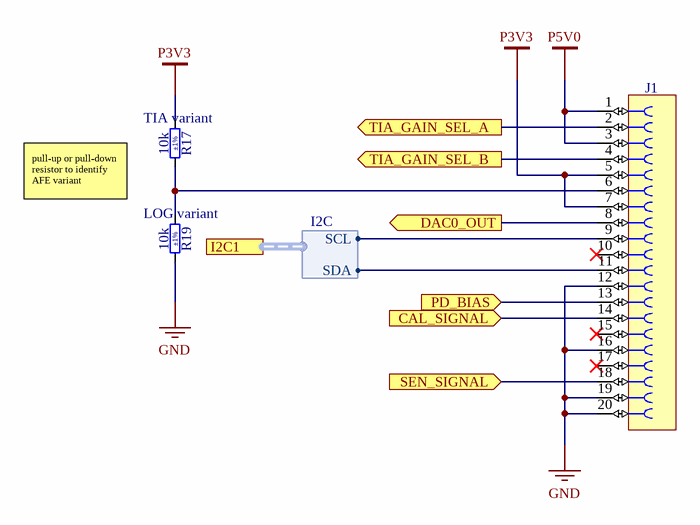
[diagram p3: b2b_connector.SchDoc]

### Parts
J1  SlimStack™  [MOLEX_52991-0208]  (value not drawn)
R17  10k  Tolerance: ±1%  [RESC1005X40N]
R19  10k  Tolerance: ±1%  [RESC1005X40N]

### Ports
CAL_SIGNAL (in), DAC0_OUT (out), I2C1 (harness I2C), PD_BIAS (in), SEN_SIGNAL (in), TIA_GAIN_SEL_A (out), TIA_GAIN_SEL_B (out)

### Harnesses
I2C: SCL, SDA

### Nets
GND: J1.12 J1.16 J1.19 J1.20 R19.1
P3V3: J1.5 J1.7 R17.2
P5V0: J1.1 J1.3
PD_BIAS: J1.13 ; port PD_BIAS
NetC18_2: J1.18 ; port SEN_SIGNAL
NetC20_2: J1.14 ; port CAL_SIGNAL
NetIC5_5: J1.11 ; port I2C1.SDA
NetIC5_6: J1.9 ; port I2C1.SCL
NetJ1_2: J1.2 ; port TIA_GAIN_SEL_A
NetJ1_4: J1.4 ; port TIA_GAIN_SEL_B
NetJ1_6: J1.6 R17.1 R19.2
NetJ1_8: J1.8 ; port DAC0_OUT

Not connected (* = marked no-connect by the designer): J1 10* 15* 17*

### Notes on the sheet
- (near R17) TIA variant
- pull-up or pull-down resistor to identify AFE variant
- (near R19) LOG variant
- Project/Equipment
- Document
- Designer
- Drawn by
- Check.by
- Copyright WUT ISE 2021.
  This documentation describes Open Hardware and is licensed under the CERN OHL v.1.1. You may redistribute and modify this documentation under the terms of the CERN OHL v.1.1. (http://ohwr.org/CERNOHL). This documentation is distributed WITHOUT ANY EXPRESS OR IMPLIED WARRANTY, INCLUDING OF MERCHANTABILITY, SATISFACTORY QUALITY AND FITNESS FOR A PARTICULAR PURPOSE. Please see the CERN OHL v.1.1 for applicable conditions.
- Contact
- File
- Last Mod.
- Print Date
- Sheet
- Size
- A3
- of
- Rev

### Library data of the parts
J1 = MOLEX_52991-0208: Connector 20 Female; Part Description: 0.50mm Pitch SlimStack™ Dual Row 20 Circuits Surface Mount Vertical Receptacle (3.00 and 4.00mm Stacking Heights); Manufacturer: MOLEX; PressFit: No; Part Number: MOLEX_52991-0208; Component Kind: Standard; Component Type: Standard; Pin Count: 20; Family: SlimStack™; Mounted: Yes; Socket: No; SMD: Yes; Sense: No; Status: None; Manufacturer Part Number: 52991-0208; ComponentHeight: 2.27mm; HelpURL: \\cern.ch\dfs\Applications\Altium\Datasheets\MOLEX_52991-0208.pdf; Author: CERN DEM BC; CreateDate: 09.12.2019; LatestRevisionDate: 09.12.2019
R17 R19 = R0402_10K_1%_0.0625W_100PPM: as R25 on sheet analog; Part Number: R0402_10K_1%_0.0625W_100PPM; Component Kind: Standard; Component Type: Standard; Pin Count: 2; Value: 10k; Status: Not Recommended; Power: 0.0625W; Manufacturer Part Number: R0402_10K_1%_0.0625W_100PPM; Case: 0402; Mounted: Yes; Sense: No; Socket: No; SMD: Yes; Manufacturer1 Example: YAGEO PHYCOMP; Manufacturer1 ComponentHeight: 0.4mm; HelpURL: \\cern.ch\dfs\Applications\Altium\Datasheets\R0402_Phycomp_RC0402.pdf; Author: CERN DEM JLC; CreateDate: 03.12.2007; LatestRevisionDate: 17.10.2012

## Nets that join several sheets
GND: analog (25 pins), log (12 pins), tia (21 pins), b2b_connector (5 pins)
P3V3: analog (C17.2 IC5.8), tia (5 pins), b2b_connector (J1.5 J1.7 R17.2)
P4V7: analog (9 pins), log (L1.2)
P5V0: analog (L3.1), tia (L2.1), b2b_connector (J1.1 J1.3)
CAL_DIV_OUT: analog (IC3.1), tia (R12.2 U3.3)
LOG_OUTPUT: analog (R16.1), log (IC9.21 IC9.22)
NetC18_2: analog (C18.2 R14.2), b2b_connector (J1.18)
NetC20_2: analog (C20.2 R24.2), b2b_connector (J1.14)
NetD1_A: analog (D1.A D2.A), log (R11.1), tia (R13.1)
NetD1_C: analog (D1.C D2.C), log (R10.1), tia (R9.1)
NetIC5_5: analog (IC5.5), b2b_connector (J1.11)
NetIC5_6: analog (IC5.6), b2b_connector (J1.9)
NetJ1_2: tia (U3.10 U4.10), b2b_connector (J1.2)
NetJ1_4: tia (U3.9 U4.9), b2b_connector (J1.4)
NetJ1_8: analog (R15.1), b2b_connector (J1.8)
PD_BIAS: analog (IC2.3 IC2.4), tia (R13.2), b2b_connector (J1.13)
TIA_OUTPUT: analog (R18.1), tia (U4.13)

## Assembly variants
TIA: not fitted C3 C5 C6 C7 C9 C11 FB1 L1 R3 R6 R6 R7 R7 R8 R8 R9 R10 R11 R12 R14 R16 R16 R19 R20 R? U1; alternate parts R18 -> CMP-2000-00032-1
LOG: not fitted C1 C1 C2 C2 C4 C6 C8 C9 C10 C12 C? C? FB? L2 R1 R1 R2 R3 R4 R4 R5 R7 R9 R10 R12 R12 R13 R14 R15 R17 R18 R? R? U2 U2 U3 U3 U4 U?